# Altium project uart_key.PrjPcb
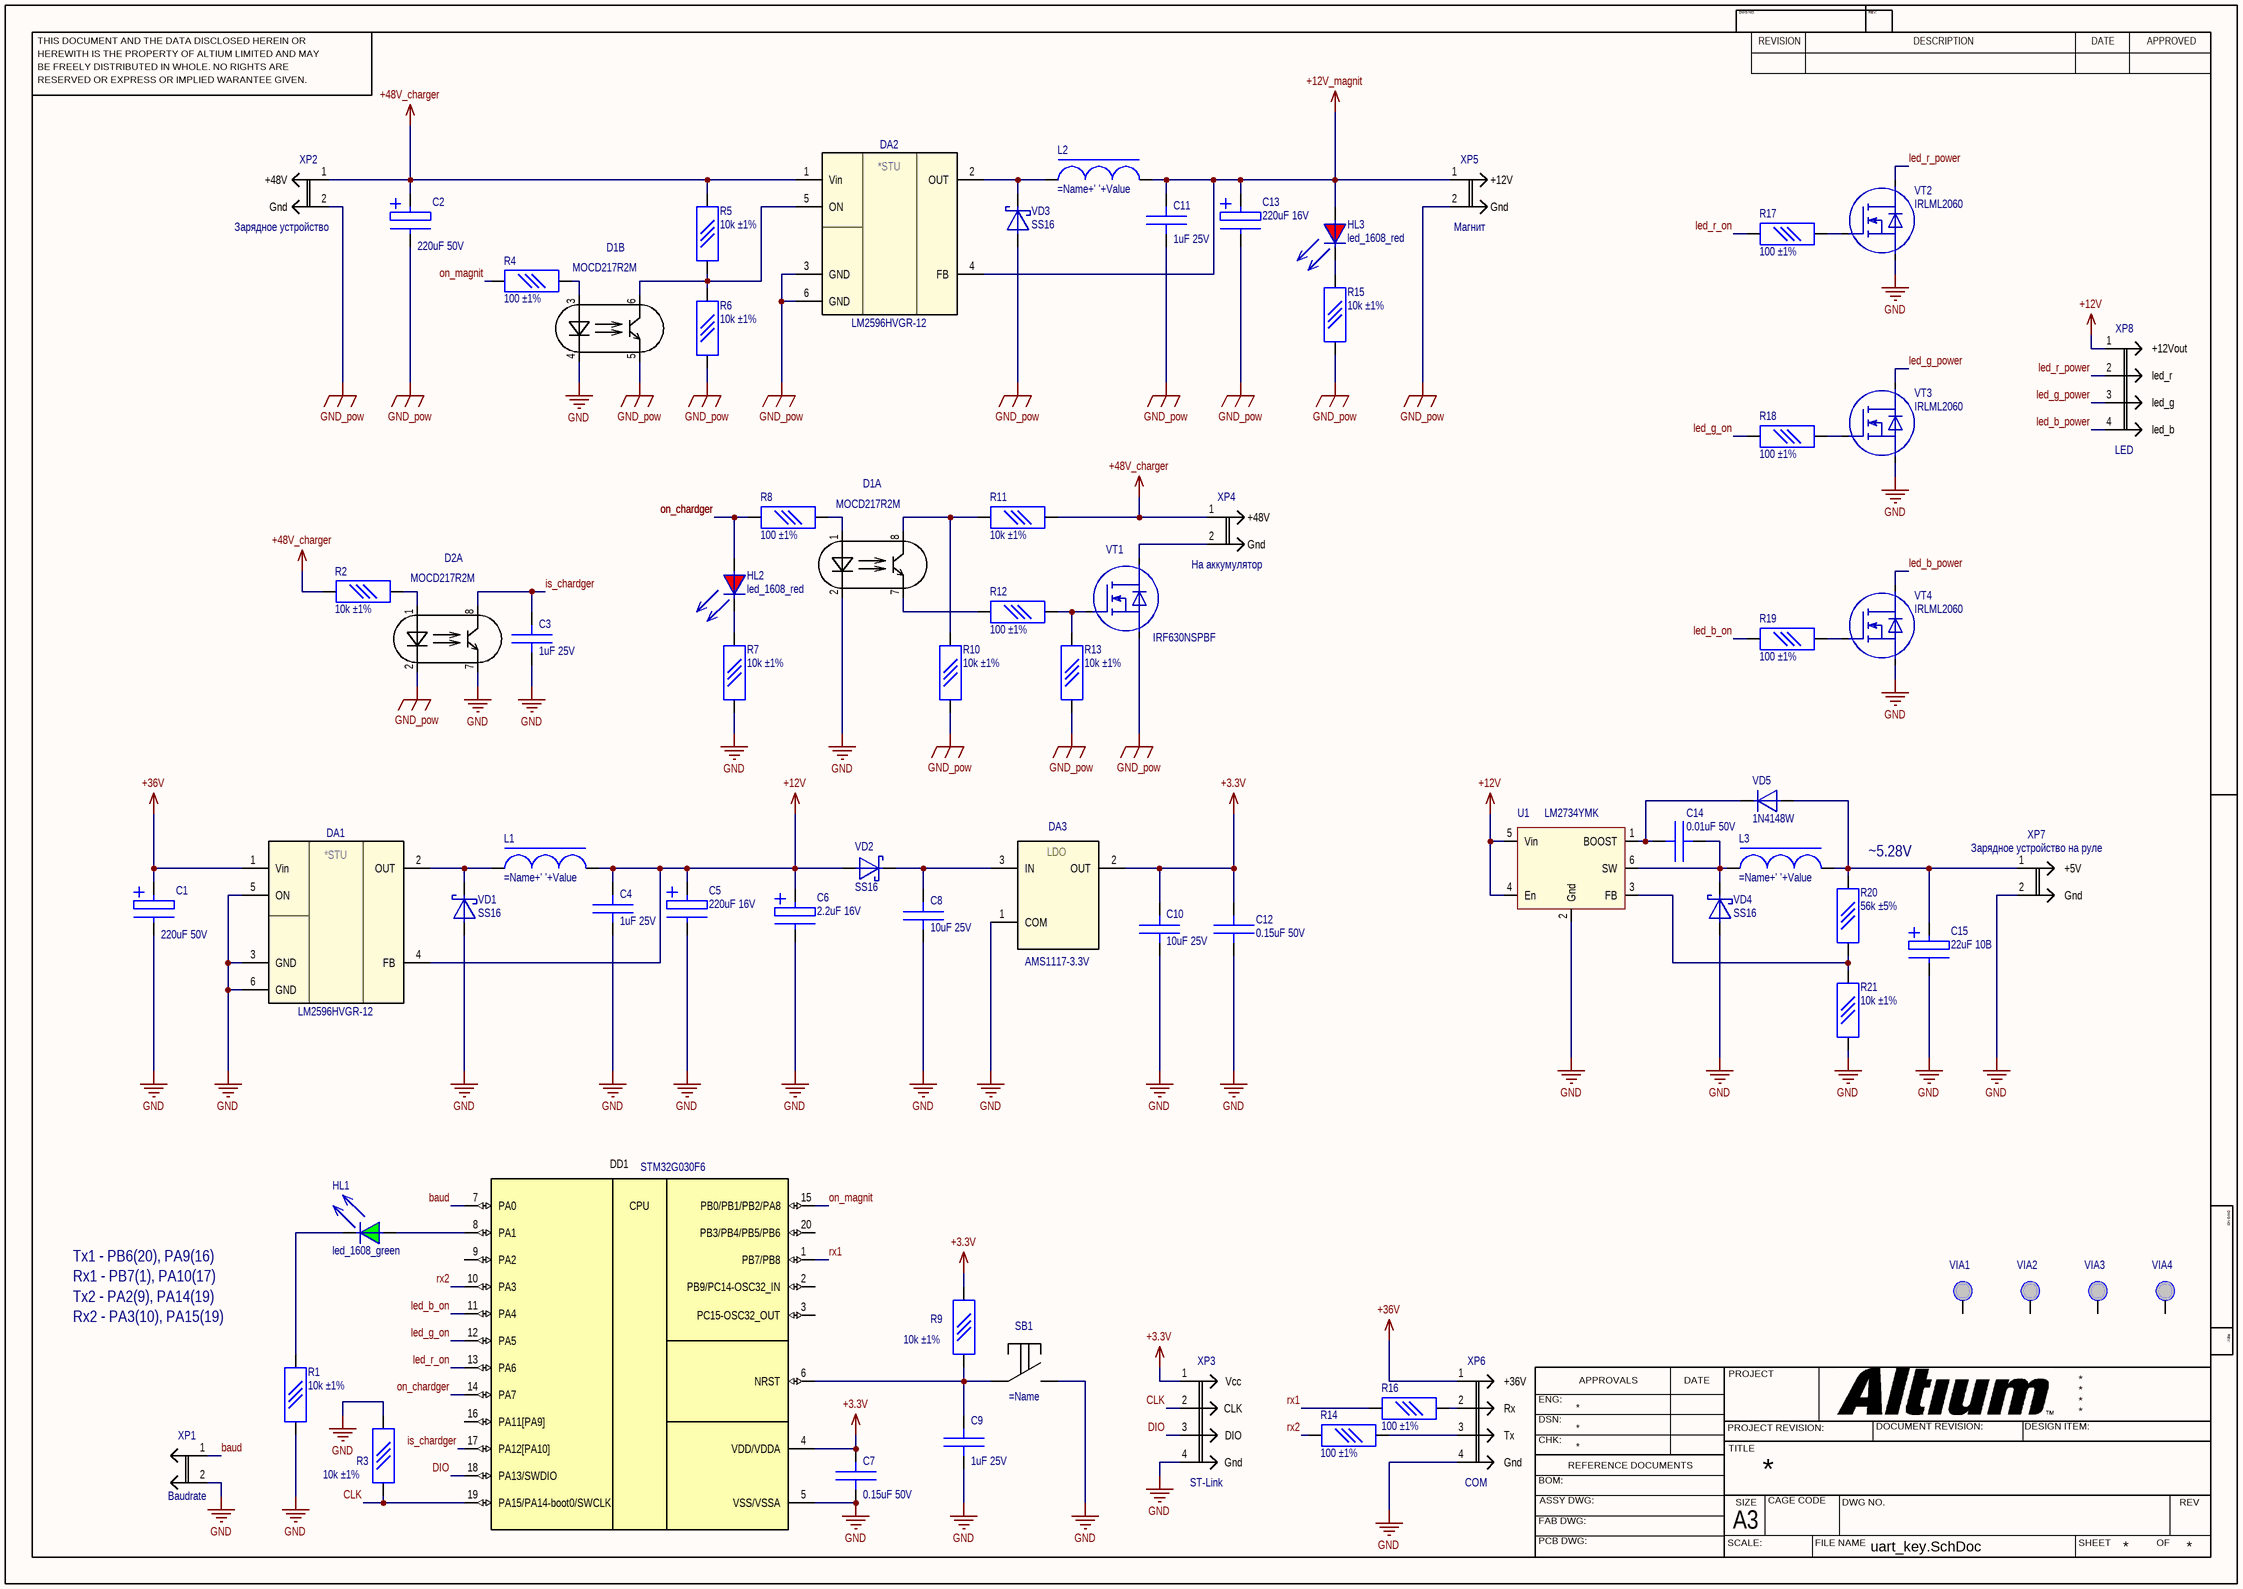
[diagram p0: uart_key.SchDoc]
1 sheet, 71 parts. Net scope: global (net labels, ports and power ports of the same name join across sheets).
Board file: uart_key.PcbDoc

## Sheet uart_key.SchDoc
size 420 x 297 mm

### Parts
C1  220uF 50V  [CAPAE_SMD_1010]
C2  220uF 50V  [CAPAE_SMD_1010]
C3  1uF 25V  [CC0603_0.8mm]
C4  1uF 25V  [CC0603_0.8mm]
C5  220uF 16V  [CAPAE_SMD_0607]
C6  2.2uF 16V  [TANT_3.2X1.6_A]
C7  0.15uF 50V  [CC0603_0.8mm]
C8  10uF 25V  [CC0603_0.8mm]
C9  1uF 25V  [CC0603_0.8mm]
C10  10uF 25V  [CC0603_0.8mm]
C11  1uF 25V  [CC0603_0.8mm]
C12  0.15uF 50V  [CC0603_0.8mm]
C13  220uF 16V  [CAPAE_SMD_0607]
C14  0.01uF 50V  [CC0603_0.8mm]
C15  22uF 10В  [TANT_3.5X2.8_B]
D1  MOCD217R2M  [SO-8_height]  (parts A,B of 2)
D2  MOCD217R2M  [SO-8_height]  (part A of 2)
DA1  LM2596HVGR-12  [TO-263-5 (D2PAK)_2_thermal_pad]
DA2  LM2596HVGR-12  [TO-263-5 (D2PAK)_2_thermal_pad]
DA3  AMS1117-3.3V  [SOT-223]
DD1  STM32G030F6  [TSSOP-20_ST]
HL1  led_1608_green  [led_1608]
HL2  led_1608_red  [led_1608]
HL3  led_1608_red  [led_1608]
L1  (no value)  [SDR1006]
L2  (no value)  [SDR1006]
L3  (no value)  [SDR0604]
R1  10k ±1%  [R0603]
R2  10k ±1%  [R0603]
R3  10k ±1%  [R0603]
R4  100 ±1%  [R0603]
R5  10k ±1%  [R0603]
R6  10k ±1%  [R0603]
R7  10k ±1%  [R0603]
R8  100 ±1%  [R0603]
R9  10k ±1%  [R0603]
R10  10k ±1%  [R0603]
R11  10k ±1%  [R0603]
R12  100 ±1%  [R0603]
R13  10k ±1%  [R0603]
R14  100 ±1%  [R0603]
R15  10k ±1%  [R0603]
R16  100 ±1%  [R0603]
R17  100 ±1%  [R0603]
R18  100 ±1%  [R0603]
R19  100 ±1%  [R0603]
R20  56k ±5%  [R0603]
R21  10k ±1%  [R0603]
SB1  (no value)  [KLS7-TS3401_4х3х2,5]
U1  LM2734YMK  [SOT-23-6]
VD1  SS16  [DO-214AC (SMA)]
VD2  SS16  [DO-214AC (SMA)]
VD3  SS16  [DO-214AC (SMA)]
VD4  SS16  [DO-214AC (SMA)]
VD5  1N4148W  [SOD-123]
VIA1  via_circle_2.2mm  [via_circle_2.2]  (value not drawn)
VIA2  via_circle_2.2mm  [via_circle_2.2]  (value not drawn)
VIA3  via_circle_2.2mm  [via_circle_2.2]  (value not drawn)
VIA4  via_circle_2.2mm  [via_circle_2.2]  (value not drawn)
VT1  IRF630NSPBF  [TO-263A (D2PAK)_thermal_pad]
VT2  IRLML2060  [SOT-23]
VT3  IRLML2060  [SOT-23]
VT4  IRLML2060  [SOT-23]
XP1  Baudrate  [PLS-2]
XP2  Зарядное устройство  Circuit_1: +48V  Circuit_2: Gnd  [DG308x2]
XP3  ST-Link  Circuit_1: Vcc  Circuit_2: CLK  Circuit_3: DIO  Circuit_4: Gnd  [B4B-ZR]
XP4  На аккумулятор  Circuit_1: +48V  Circuit_2: Gnd  [DG308x2]
XP5  Магнит  Circuit_1: +12V  Circuit_2: Gnd  [DG308x2]
XP6  COM  Circuit_1: +36V  Circuit_2: Rx  Circuit_3: Tx  Circuit_4: Gnd  [JST_XH_B4B-XH-A_1x04_P2.50mm_Vertical]
XP7  Зарядное устройство на руле  Circuit_2: Gnd  [B2B-XH-A]
XP8  LED  Circuit_1: +12Vout  Circuit_2: led_r  Circuit_3: led_g  Circuit_4: led_b  [JST_XH_B4B-XH-A_1x04_P2.50mm_Vertical]

### Nets
+3.3V: C7.1 C10.1 C12.1 DA3.2(OUT) DD1.4(VDD/VDDA) R9.1(BOT) XP3.1
+12V: C4.1 C5.2(+) C6.2(+) DA1.4(FB) L1.2 U1.4(En) U1.5(Vin) VD2.2(A) XP8.1
+12V_magnit: C11.1 C13.2(+) DA2.4(FB) HL3.2(A) L2.2 XP5.1
+36V: C1.2(+) DA1.1(Vin) XP6.1
+48V_charger: C2.2(+) DA2.1(Vin) R2.2(TOP) R5.1(BOT) R11.2(TOP) XP2.1 XP4.1
GND: C1.1(-) C3.2 C4.2 C5.1(-) C6.1(-) C7.2 C8.2 C9.2 C10.2 C12.2 C15.1(-) D1.2 D1.4 D2.7 DA1.3(GND) DA1.5(ON) DA1.6 DA3.1(COM) DD1.5(VSS/VSSA) R1.2(TOP) R3.1(BOT) R7.2(TOP) R21.2(TOP) SB1.NO U1.2(Gnd) VD1.2(A) VD4.2(A) VT2.2(S) VT3.2(S) VT4.2(S) XP1.2 XP3.4 XP6.4 XP7.2
GND_pow: C2.1(-) C11.2 C13.1(-) D1.5 D2.2 DA2.3(GND) DA2.6 R6.2(TOP) R10.2(TOP) R13.2(TOP) R15.2(TOP) VD3.2(A) VT1.3(S) XP2.2 XP5.2
baud: DD1.7(PA0) XP1.1
CLK: DD1.19(PA15/PA14-boot0/SWCLK) R3.2(TOP) XP3.2
DIO: DD1.18(PA13/SWDIO) XP3.3
is_chardger: C3.1 D2.8 DD1.17(PA12[PA10])
led_b_on: DD1.11(PA4) R19.1(BOT)
led_b_power: VT4.3(D) XP8.4
led_g_on: DD1.12(PA5) R18.1(BOT)
led_g_power: VT3.3(D) XP8.3
led_r_on: DD1.13(PA6) R17.1(BOT)
led_r_power: VT2.3(D) XP8.2
on_chardger: DD1.14(PA7) HL2.2(A) R8.1(BOT)
on_magnit: DD1.15(PB0/PB1/PB2/PA8) R4.1(BOT)
rx1: DD1.1(PB7/PB8) R16.1(BOT)
rx2: DD1.10(PA3) R14.1(BOT)
NetC8_1: C8.1 DA3.3(IN) VD2.1(C)
NetC9_1: C9.1 DD1.6(NRST) R9.2(TOP) SB1.COM
NetC14_1: C14.1 U1.1(BOOST) VD5.1(C)
NetC14_2: C14.2 L3.1 U1.6(SW) VD4.1(C)
NetC15_2: C15.2(+) L3.2 R20.1(BOT) VD5.2(A) XP7.1
NetD1_1: D1.1 R8.2(TOP)
NetD1_3: D1.3 R4.2(TOP)
NetD1_6: D1.6 DA2.5(ON) R5.2(TOP) R6.1(BOT)
NetD1_7: D1.7 R12.1(BOT)
NetD1_8: D1.8 R10.1(BOT) R11.1(BOT)
NetD2_1: D2.1 R2.1(BOT)
NetDA1_2: DA1.2(OUT) L1.1 VD1.1(C)
NetDA2_2: DA2.2(OUT) L2.1 VD3.1(C)
NetDD1_8: DD1.8(PA1) HL1.2(A)
NetHL1_1: HL1.1(C) R1.1(BOT)
NetHL2_1: HL2.1(C) R7.1(BOT)
NetHL3_1: HL3.1(C) R15.1(BOT)
NetR12_2: R12.2(TOP) R13.1(BOT) VT1.1(G)
NetR14_2: R14.2(TOP) XP6.3
NetR16_2: R16.2(TOP) XP6.2
NetR17_2: R17.2(TOP) VT2.1(G)
NetR18_2: R18.2(TOP) VT3.1(G)
NetR19_2: R19.2(TOP) VT4.1(G)
NetR20_2: R20.2(TOP) R21.1(BOT) U1.3(FB)
NetVT1_2: VT1.2(D) XP4.2

Not connected (* = marked no-connect by the designer): DD1 2(PB9/PC14-OSC32_IN) 3(PC15-OSC32_OUT) 9(PA2) 16(PA11[PA9]) 20(PB3/PB4/PB5/PB6); VIA1 1(VIA?); VIA2 1(VIA?); VIA3 1(VIA?); VIA4 1(VIA?)

### Notes on the sheet
- ~5.28V
- Tx1 - PB6(20), PA9(16)
- Rx1 - PB7(1), PA10(17)
- Tx2 - PA2(9), PA14(19)
- (near R1) Rx2 - PA3(10), PA15(19)
- THIS DOCUMENT AND THE DATA DISCLOSED HEREIN OR
- HEREWITH IS THE PROPERTY OF ALTIUM LIMITED AND MAY
- DWG NO:
- REVISION
- REV:
- DESCRIPTION
- DATE
- APPROVED
- BE FREELY DISTRIBUTED IN WHOLE. NO RIGHTS ARE
- RESERVED OR EXPRESS OR IMPLIED WARANTEE GIVEN.
- ENG:
- APPROVALS
- PROJECT
- DSN:
- CHK:
- REFERENCE DOCUMENTS
- PROJECT REVISION:
- TITLE
- DOCUMENT REVISION:
- DESIGN ITEM:
- BOM:
- FAB DWG:
- PCB DWG:
- ASSY DWG:
- SCALE:
- A3
- SIZE
- CAGE CODE
- FILE NAME
- DWG NO.
- SHEET
- OF
- REV
- (in symbol LM2596HVGR-12) *STU
- (in symbol STM32G030F6) CPU

### Library data of the parts
C1 C2 C5 C6 C13 C15 = Capacitor_elec: Type: Конденсатор электр.; Tolerance: ±10%; Name: Capacitor_elec
  C1 C2: Value: 220uF; Voltage: 50V; Link1: https://www.chipdip.ru/product0/9000565744
  C5 C13: Value: 220uF; Voltage: 16V; Link1: https://www.chipdip.ru/product0/9000565741
  C6: Value: 2.2uF; Voltage: 16V; Link1: https://www.chipdip.ru/product0/9000686417
  C15: Value: 22uF; Voltage: 10В; Link1: https://www.chipdip.ru/product0/9000502415
C3 C4 C7-C12 C14 = Capacitor: Type: Конденсатор керам.; Tolerance: ±10%; Name: Capacitor
  C3 C4 C9 C11: Value: 1uF; Voltage: 25V; Link1: https://www.chipdip.ru/product/grm188r71e105ka12d
  C7 C12: Value: 0.15uF; Voltage: 50V; Link1: https://www.chipdip.ru/product0/9000081151
  C8 C10: Value: 10uF; Voltage: 25V; Link1: https://www.chipdip.ru/product/grm188r61e106m
  C14: Value: 0.01uF; Voltage: 50V; Link1: https://www.chipdip.ru/product0/9000143994
D1 D2 = MOCD217R2M: Type: Оптопара; Name: MOCD217R2M; Link1: https://www.chipdip.ru/product/mocd217r2m
DA3 = AMS1117-___V: Value: 3.3V; Name: AMS1117-; Link1: https://www.chipdip.ru/product/ams1117-3.3; Type: LDO
DD1 = STM32G030F6: ARM-based 32-bit MCU, up to 32 KB Flash, crystal-less USB  FS 2.0, CAN, 8 timers, ADC & comm. interfaces, 2.0 - 3.6 V; Name: STM32G030F6; Link1: *; Type: Микроконтроллер
HL1 = led_1608_green: Type: Светодиод; Name: led_1608_green; Link1: https://www.chipdip.ru/product/to-1608bc-pg
HL2 HL3 = led_1608_red: Type: Светодиод; Name: led_1608_red; Link1: https://www.chipdip.ru/product/to-1608bc-mre
L1 L2 = Inductor: Value: 33uH; Type: Индуктивность; Name: SDR1006; Link1: https://www.chipdip.ru/product/sdr1006-330kl
L3 = Inductor: Type: Индуктивность; Value: 10uH; Name: SDR0604; Link1: https://www.chipdip.ru/product/sdr0604-100ml
R1-R3 R5-R7 R9-R11 R13 R15 R20 R21 = Res_0603: Name: R0603; Type: Резистор SMD
  R1-R3 R5-R7 R9-R11 R13 R15 R21: Value: 10k; Link1: https://www.chipdip.ru/product0/9000079736; Tolerance: ±1%
  R20: Value: 56k; Link1: https://www.chipdip.ru/product0/32172; Tolerance: ±5%
R4 R8 R12 R14 R16-R19 = Res_0603: Value: 100; Name: R0603; Link1: https://www.chipdip.ru/product0/9000079616; Tolerance: ±1%; Type: Резистор SMD
SB1 = Tact_4х3х2.5_SMD: Name: KLS7-TS3401_4х3х2,5; Type: Кнопка тактовая; Link1: https://www.chipdip.ru/product/kls7-ts3401-2-5-180-tvaf11
VD1-VD4 = SS16: Type: Диод Шоттки; Name: SS16; Link1: https://www.chipdip.ru/product/ss16
VD5 = Diode: Type: Диод; Name: 1N4148W; Link1: https://www.chipdip.ru/product/1n4148w-5
VT1 = IRF630NSPBF: Type: MOSFET N-chanel; Name: IRF630NSPBF; Link1: https://www.chipdip.ru/product/irf630nspbf
VT2-VT4 = IRLML2060: Type: MOSFET N-chanel; Name: IRLML2060; Link1: https://www.chipdip.ru/product/irlml2060trpbf
XP1 = Conn_01_02pin: Name: Baudrate; Type: PLS-2; Link1: https://www.chipdip.ru/product/pls-2; Link2: *; Link3: *
XP2 XP4 XP5 = DG308x2: Name: DG308x2; Link1: https://www.chipdip.ru/product/dg308-2.54-02p-14-00ah; Type: Клеммник
XP3 = B4B-ZR_conn_01x04_st_link: Name: B4B-ZR; Link1: https://www.chipdip.ru/product/b4b-zr; Link2: *; Link3: *; Type: Разъём
XP6 XP8 = JST_XH_B4B-XH-A_1x04_P2.50mm_Vertical: Name: JST_XH_B4B-XH-A_1x04_P2.50mm_Vertical; Link1: https://www.chipdip.ru/product/b4b-xh-a; Link2: https://www.chipdip.ru/product/xhp-4?from=rec_product; Link3: https://www.chipdip.ru/product/sxh-001t-0.6?from=rec_product; Type: Разъём
XP7 = Conn_01_02pin: Link2: *https://www.chipdip.ru/product/xhp-2; Link3: *https://www.chipdip.ru/product/sxh-001t-0.6; Name: B2B-XH-A; Type: Разъём; Link1: https://www.chipdip.ru/product0/8384581689; +5V: +5V
DA1 DA2 = LM2596HVGR-12: Name: LM2596HVGR-12; Type: DC-DC; Link1: https://www.chipdip.ru/product/lm2596hvgr-12
U1 = LM2734YMK: Name: LM2734YMK; Type: DCDC; Link1: https://www.chipdip.ru/product/lm2734ymk-nopb
VIA1-VIA4 = via_circle_2.2mm: Name: via_circle_2.2mm; Type: Отверстие для крепежа